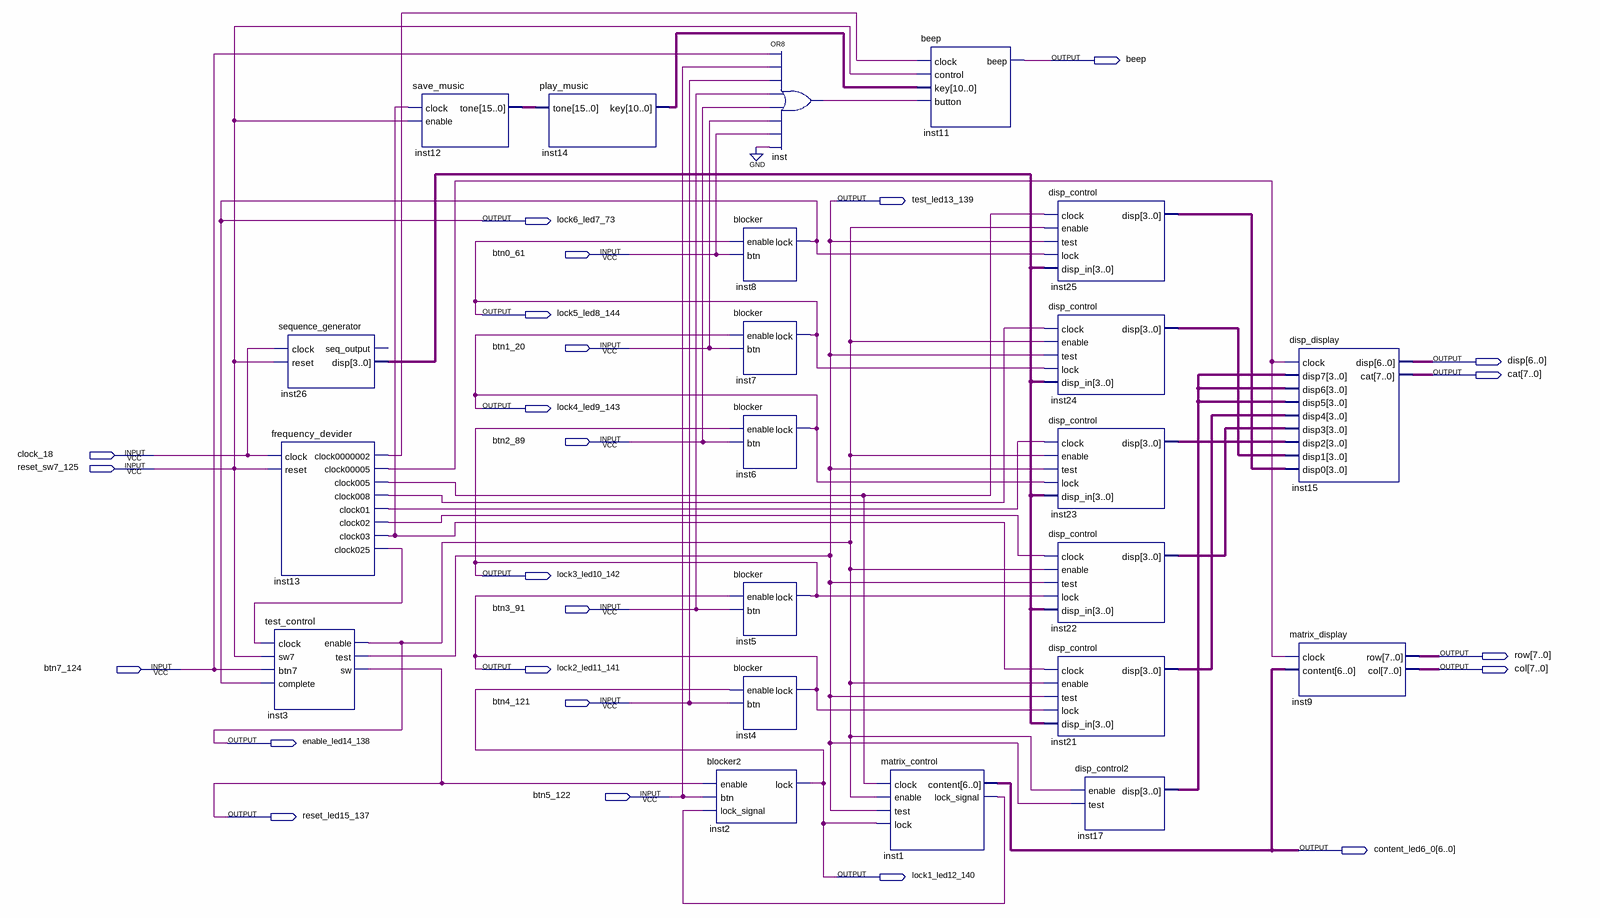
[diagram p0: schematic sheet]
// Quartus schematic final_1.bdf as structural Verilog: 22 symbols, 24 pins
module final_1 (
  input  btn0_61,
  input  btn1_20,
  input  btn2_89,
  input  clock_18,
  input  reset_sw7_125,
  input  btn3_91,
  input  btn7_124,
  input  btn4_121,
  input  btn5_122,
  output beep,
  output test_led13_139,
  output lock6_led7_73,
  output lock5_led8_144,
  output [6:0] disp,
  output [7:0] cat,
  output lock4_led9_143,
  output lock3_led10_142,
  output [7:0] row,
  output lock2_led11_141,
  output [7:0] col,
  output enable_led14_138,
  output reset_led15_137,
  output [6:0] content_led6_0,
  output lock1_led12_140
);

  wire inst1_lock_signal, inst13_clock01, inst13_clock02, inst13_clock0000002, inst13_clock03,
       inst13_clock00005, inst13_clock005, inst13_clock008, inst13_clock025, inst_out;
  wire [3:0] inst17_disp, inst21_disp, inst22_disp, inst23_disp, inst24_disp, inst25_disp, inst26_disp;
  wire [10:0] inst14_key;
  wire [15:0] inst12_tone;

  sequence_generator inst26 (.clock(clock_18), .reset(reset_sw7_125), .disp(inst26_disp));  // open: seq_output
  frequency_devider inst13 (
    .clock(clock_18), .reset(reset_sw7_125), .clock0000002(inst13_clock0000002),
    .clock00005(inst13_clock00005), .clock005(inst13_clock005), .clock008(inst13_clock008),
    .clock01(inst13_clock01), .clock02(inst13_clock02), .clock03(inst13_clock03), .clock025(inst13_clock025));
  test_control inst3 (
    .clock(inst13_clock025), .sw7(reset_sw7_125), .btn7(btn7_124), .complete(lock6_led7_73),
    .enable(enable_led14_138), .test(test_led13_139), .sw(reset_led15_137));
  save_music inst12 (.clock(inst13_clock03), .enable(reset_sw7_125), .tone(inst12_tone));
  play_music inst14 (.tone(inst12_tone), .key(inst14_key));
  blocker inst8 (.enable(lock5_led8_144), .btn(btn0_61), .lock(lock6_led7_73));
  blocker inst7 (.enable(lock4_led9_143), .btn(btn1_20), .lock(lock5_led8_144));
  blocker inst6 (.enable(lock3_led10_142), .btn(btn2_89), .lock(lock4_led9_143));
  blocker inst5 (.enable(lock2_led11_141), .btn(btn3_91), .lock(lock3_led10_142));
  blocker inst4 (.enable(lock1_led12_140), .btn(btn4_121), .lock(lock2_led11_141));
  blocker2 inst2 (.enable(reset_led15_137), .btn(btn5_122), .lock_signal(inst1_lock_signal), .lock(lock1_led12_140));
  or inst (inst_out, btn7_124, btn5_122, btn4_121, btn3_91, btn2_89, btn1_20, btn0_61, 1'b0);
  matrix_control inst1 (
    .clock(inst13_clock005), .enable(enable_led14_138), .test(test_led13_139), .lock(lock1_led12_140),
    .content(content_led6_0), .lock_signal(inst1_lock_signal));
  beep inst11 (.clock(inst13_clock0000002), .control(reset_sw7_125), .key(inst14_key), .button(inst_out), .beep(beep));
  disp_control inst25 (
    .clock(inst13_clock005), .enable(enable_led14_138), .test(test_led13_139), .lock(lock6_led7_73),
    .disp_in(inst26_disp), .disp(inst25_disp));
  disp_control inst24 (
    .clock(inst13_clock008), .enable(enable_led14_138), .test(test_led13_139), .lock(lock5_led8_144),
    .disp_in(inst26_disp), .disp(inst24_disp));
  disp_control inst23 (
    .clock(inst13_clock01), .enable(enable_led14_138), .test(test_led13_139), .lock(lock4_led9_143),
    .disp_in(inst26_disp), .disp(inst23_disp));
  disp_control inst22 (
    .clock(inst13_clock02), .enable(enable_led14_138), .test(test_led13_139), .lock(lock3_led10_142),
    .disp_in(inst26_disp), .disp(inst22_disp));
  disp_control inst21 (
    .clock(inst13_clock03), .enable(enable_led14_138), .test(test_led13_139), .lock(lock2_led11_141),
    .disp_in(inst26_disp), .disp(inst21_disp));
  disp_control2 inst17 (.enable(enable_led14_138), .test(test_led13_139), .disp(inst17_disp));
  disp_display inst15 (
    .clock(inst13_clock00005), .disp7(inst17_disp), .disp6(inst17_disp), .disp5(inst17_disp),
    .disp4(inst21_disp), .disp3(inst22_disp), .disp2(inst23_disp), .disp1(inst24_disp), .disp0(inst25_disp),
    .disp(disp), .cat(cat));
  matrix_display inst9 (.clock(inst13_clock00005), .content(content_led6_0), .row(row), .col(col));
endmodule
